# Altium project Digital_Potentiometer.PrjPcb
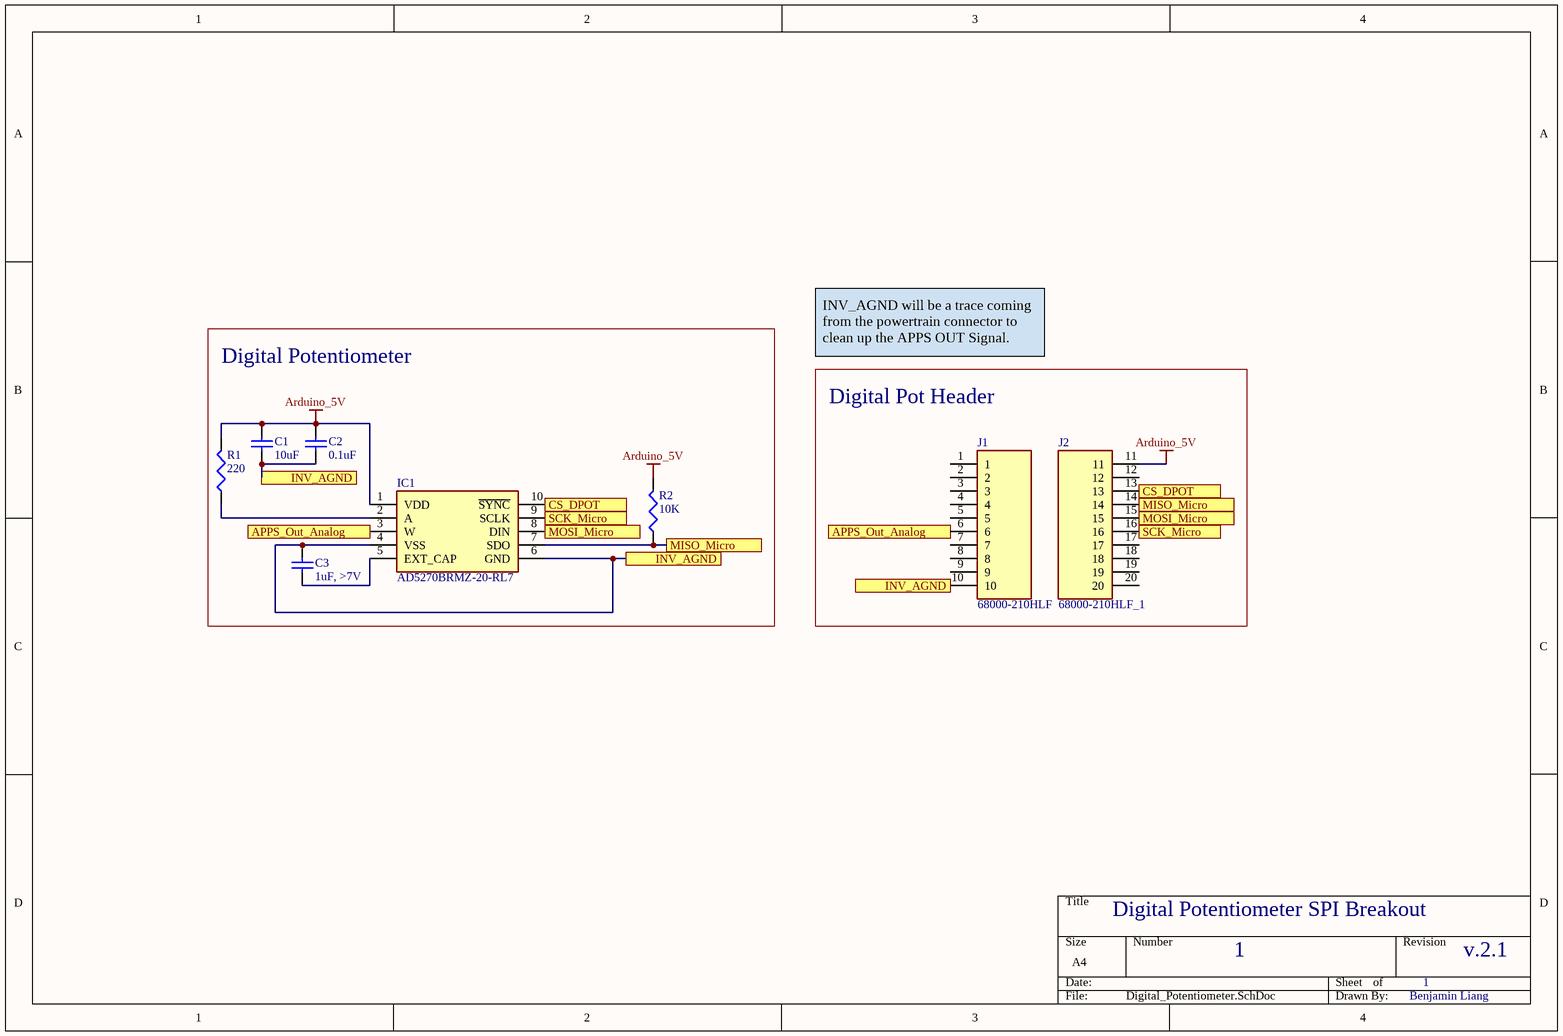
[diagram p0: Digital_Potentiometer.SchDoc]
1 sheet, 8 parts. Net scope: flat (ports and power ports of the same name join across sheets).
Board file: Digital_Potentiometer.PcbDoc

## Sheet Digital_Potentiometer.SchDoc
size A4; SheetNumber: 1; SheetTotal: 1

### Parts
C1  10uF  [C1206]
C2  0.1uF  [C1206]
C3  1uF, >7V  [C1206]
IC1  AD5270BRMZ-20-RL7  [SOP50P490X110-10N]
J1  68000-210HLF  [HDRV10W63P0X254_1X10_2540X241X858P]
J2  68000-210HLF_1  [HDRV10W63P0X254_1X10_2540X241X858P]
R1  220  [J1-0603]
R2  10K  [J1-0603]

### Blocks framed on the sheet
Digital Potentiometer: C1-C3 IC1 R1 R2
Digital Pot Header: J1 J2

### Ports
APPS_Out_Analog, CS_DPOT, INV_AGND, MISO_Micro, MOSI_Micro, SCK_Micro

### Nets
Arduino_5V: C1.1 C2.1 IC1.1(VDD) J2.11 R1.2 R2.2
NetC1_2: C1.2 C2.2 C3.1 IC1.4(VSS) IC1.6(GND) J1.10 ; port INV_AGND
NetC3_2: C3.2 IC1.5(EXT_CAP)
NetIC1_2: IC1.2(A) R1.1
NetIC1_3: IC1.3(W) J1.6 ; port APPS_Out_Analog
NetIC1_7: IC1.7(SDO) J2.14 R2.1 ; port MISO_Micro
NetIC1_8: IC1.8(DIN) J2.15 ; port MOSI_Micro
NetIC1_9: IC1.9(SCLK) J2.16 ; port SCK_Micro
NetIC1_10: IC1.10(~{SYNC}) J2.13 ; port CS_DPOT

Not connected (* = marked no-connect by the designer): J1 1 2 3 4 5 7 8 9; J2 12 17 18 19 20

### Notes on the sheet
- INV_AGND will be a trace coming from the powertrain connector to clean up the APPS OUT Signal.
- Digital Potentiometer SPI Breakout
- 1
- v.2.1
- Benjamin Liang

### Library data of the parts
C1-C3 = Cap Semi: Capacitor (Semiconductor SIM Model); Value: 100nF; Published: 8-Jun-2000; LatestRevisionDate: 29-May-2009; LatestRevisionNote: IPC-7351 Footprint Added.; PackageReference: C1206; Publisher: Altium Limited; PackageDescription: Chip Capacitor
IC1 = AD5270BRMZ-20-RL7: Integrated Circuit; Manufacturer_Name: Analog Devices; Datasheet Link: https://componentsearchengine.com/Datasheets/1/AD5270BRMZ-20-RL7.pdf; Height: 1.1mm; Manufacturer_Part_Number: AD5270BRMZ-20-RL7; Mouser Part Number: 584-AD5270BRMZ-20-R7; Mouser Price/Stock: https://www.mouser.co.uk/ProductDetail/Analog-Devices/AD5270BRMZ-20-RL7?qs=NmRFExCfTkGXQbgPC%2Fq9Tw%3D%3D; Arrow Part Number: AD5270BRMZ-20-RL7; Arrow Price/Stock: https://www.arrow.com/en/products/ad5270brmz-20-rl7/analog-devices?region=nac
J1 = 68000-210HLF: Connector; Manufacturer_Name: Amphenol; Datasheet Link: https://cdn.amphenol-icc.com/media/wysiwyg/files/drawing/68000.pdf; Height: 8.58mm; Manufacturer_Part_Number: 68000-210HLF; Mouser Part Number: 649-68000-210HLF; Mouser Price/Stock: https://www.mouser.co.uk/ProductDetail/Amphenol-FCI/68000-210HLF?qs=QKvFUfBIyQINb7f%2F4SDc2A%3D%3D; Arrow Part Number: 68000-210HLF; Arrow Price/Stock: https://www.arrow.com/en/products/68000-210hlf/amphenol-fci
J2 = 68000-210HLF_1: Connector; Manufacturer_Name: Amphenol; Datasheet Link: https://cdn.amphenol-icc.com/media/wysiwyg/files/drawing/68000.pdf; Height: 8.58mm; Manufacturer_Part_Number: 68000-210HLF; Mouser Part Number: 649-68000-210HLF; Mouser Price/Stock: https://www.mouser.co.uk/ProductDetail/Amphenol-FCI/68000-210HLF?qs=QKvFUfBIyQINb7f%2F4SDc2A%3D%3D; Arrow Part Number: 68000-210HLF; Arrow Price/Stock: https://www.arrow.com/en/products/68000-210hlf/amphenol-fci
R1 = Res3: Resistor; Published: 8-Jun-2000; LatestRevisionDate: 29-May-2009; LatestRevisionNote: IPC-7351 Footprint Added.; PackageReference: J1-0603; Publisher: Altium Limited; PackageDescription: Chip Resistor; Value: 220
R2 = Res3: Resistor; Value: 220; Published: 8-Jun-2000; LatestRevisionDate: 29-May-2009; LatestRevisionNote: IPC-7351 Footprint Added.; PackageReference: J1-0603; Publisher: Altium Limited; PackageDescription: Chip Resistor